# Altium schematic sheet Oscillator.SchDoc
size A4; SheetNumber: 4; SheetTotal: 9
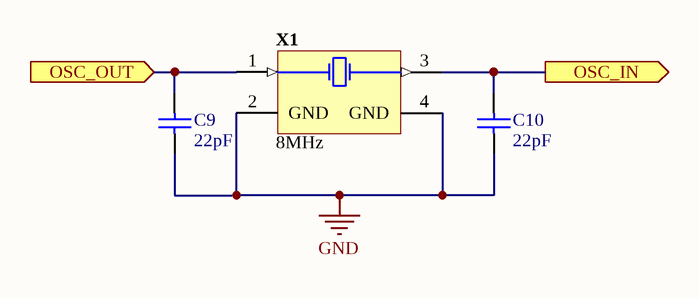
[diagram p0: Oscillator.SchDoc]

## Parts
C9  22pF  [CAPC1608X90X35ML10T15]
C10  22pF  [CAPC1608X90X35ML10T15]
X1  8MHz  [ABRA-ABM3B_V]

## Ports
OSC_IN (out), OSC_OUT (in)

## Nets
GND: C9.1 C10.1 X1.2(GND) X1.4(GND)
OSC_IN: C10.2 X1.3(X2) ; port OSC_IN
OSC_OUT: C9.2 X1.1(X1) ; port OSC_OUT

## Library data of the parts
C9 C10 = CMP-2000-04945-1: Chip Capacitor, 22 pF, +/- 5%, 50 V, -55 to 125 degC, 0603 (1608 Metric), RoHS, Tape and Reel; Manufacturer: Murata; Rated Voltage: 50V; Dielectric: C0G; Capacitance: 22pF; Manufacturer URL: http://www.murata.com/; Datasheet Version: Jul-06; Package Reference: 603; Tolerance (%): ±5%; Case Size/Dimension: 0603; Package Description: 2-Pin Surface Mount Device, Body 1.6 x 0.8 mm; Datasheet URL: https://datasheet.ciiva.com/11786/0900766b807a1cab-11786398.pdf
X1 = CMP-1688-00002-1: Ceramic SMD Crystal, 8 MHz, +/- 20 ppm, 200 Ohm, -20 to 70 degC, 4-Pin SMD, RoHS, Tape and Reel; Max Supply Voltage: 45 V; Outputs: 4; Min Supply Voltage: 8.2 V; Output Voltage: 3.3 V; Switching Frequency: 30 KHz; Output Current: 1.8 A; Packaging: Rail/Tube; ComponentLink2Description: Datasheet; REACH SVHC: No SVHC; ComponentLink1URL: http://www.abracon.com/; PackageReference: ABM3B; Weight: 0.004233 oz; Height: 1.05 mm; ComponentLink2URL: http://www.abracon.com/Resonators/abm3b.pdf; Mount: Surface Mount; Min Operating Temperature: -40 degC; Max Operating Temperature: 85 degC; Package Quantity: 50; PackageDescription: 4-Pin Surface Mount Device, Body 5 x 3.2 mm; Pins: 28; DatasheetVersion: Aug-15; ComponentLink1Description: Manufacturer URL; RoHSCompliant: true; Radiation Hardening: No; Length: 9.8 mm; Width: 4.5 mm